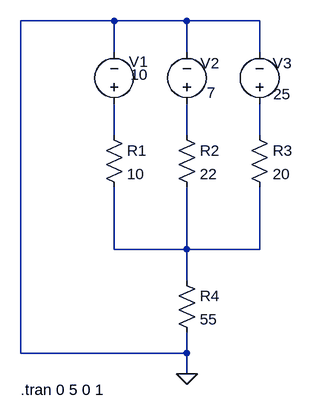
[diagram p0: schematic Application_Theoreme_Millman.asc]
Application_Theoreme_Millman.asc, the LTspice schematic file:
Version 4
SHEET 1 880 680
WIRE 144 -48 0 -48
WIRE 256 -48 144 -48
WIRE 368 -48 256 -48
WIRE 144 0 144 -48
WIRE 256 0 256 -48
WIRE 368 0 368 -48
WIRE 144 128 144 80
WIRE 256 128 256 80
WIRE 368 128 368 80
WIRE 144 304 144 208
WIRE 256 304 256 208
WIRE 256 304 144 304
WIRE 368 304 368 208
WIRE 368 304 256 304
WIRE 256 352 256 304
WIRE 0 464 0 -48
WIRE 256 464 256 432
WIRE 256 464 0 464
WIRE 256 496 256 464
FLAG 256 496 0
DATAFLAG 0 272 ""
SYMBOL res 128 112 R0
SYMATTR InstName R1
SYMATTR Value 10
SYMATTR SpiceLine tol=0
SYMBOL res 240 112 R0
SYMATTR InstName R2
SYMATTR Value 22
SYMATTR SpiceLine tol=0
SYMBOL res 352 112 R0
SYMATTR InstName R3
SYMATTR Value 20
SYMATTR SpiceLine tol=0
SYMBOL voltage 144 96 R180
WINDOW 0 -52 81 Left 2
WINDOW 3 -52 61 Left 2
SYMATTR InstName V1
SYMATTR Value 10
SYMATTR SpiceLine Rser=0
SYMBOL voltage 256 96 R180
WINDOW 0 -50 79 Left 2
WINDOW 3 -44 33 Left 2
WINDOW 123 0 0 Left 0
WINDOW 39 0 0 Left 0
SYMATTR InstName V2
SYMATTR Value 7
SYMBOL voltage 368 96 R180
WINDOW 0 -50 79 Left 2
WINDOW 3 -48 31 Left 2
WINDOW 123 0 0 Left 0
WINDOW 39 0 0 Left 0
SYMATTR InstName V3
SYMATTR Value 25
SYMBOL res 240 336 R0
SYMATTR InstName R4
SYMATTR Value 55
SYMATTR SpiceLine tol=0
TEXT 0 520 Left 2 !.tran 0 5 0 1

The netlist it stands for:
* Application_Theoreme_Millman.asc
R1 N001 N004 10 tol=0
R2 N002 N004 22 tol=0
R3 N003 N004 20 tol=0
V1 N001 0 10 Rser=0
V2 N002 0 7
V3 N003 0 25
R4 N004 0 55 tol=0
.tran 0 5 0 1
.backanno
.end